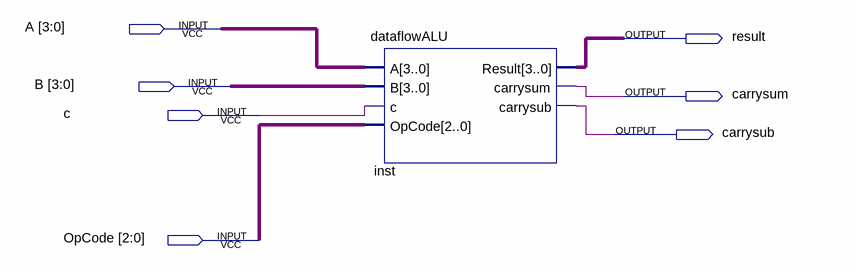
[diagram p0: schematic sheet]
// Quartus schematic Alu flow.bdf as structural Verilog: 1 symbols, 7 pins
module \Alu_flow  (
  input  [3:0] A,
  input  [3:0] B,
  input  c,
  input  [2:0] OpCode,
  output result,
  output carrysum,
  output carrysub
);

  wire [3:0] inst_result;

  dataflowALU inst (
    .A(A), .B(B), .c(c), .OpCode(OpCode), .Result(inst_result), .carrysum(carrysum), .carrysub(carrysub));
endmodule
